# EAGLE design spi-devices (EAGLE 7.6.0)
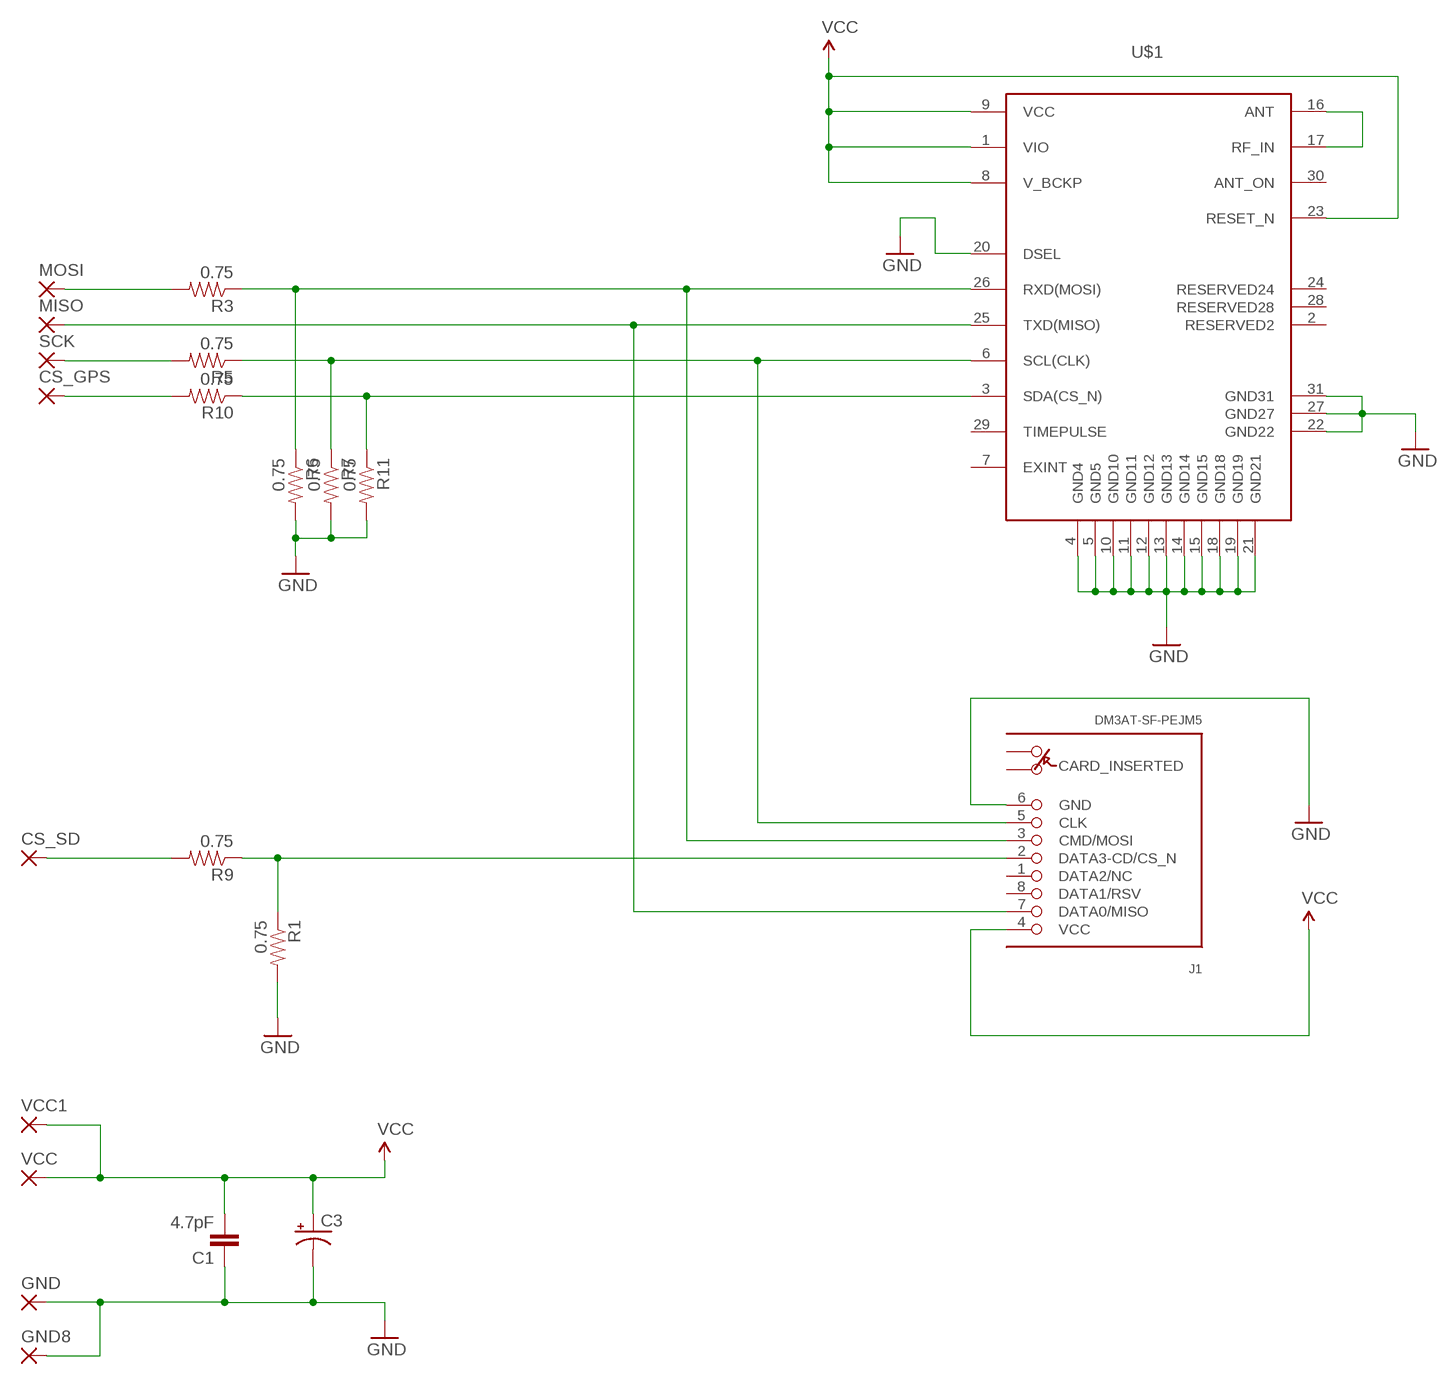
[diagram p0: schematic, sheet 1]

## Parts
C1  4.7pF  C-EUC0603  [C0603]
C3  CAP_POL3528  [EIA3528]
CS_GPS  2,54/0,9  [2,54/0,9]
CS_SD  2,54/0,9  [2,54/0,9]
GND  2,54/0,9  [2,54/0,9]
GND8  2,54/0,9  [2,54/0,9]
J1  DM3AT-SF-PEJM5  [DM3AT-SF-PEJM5]
MISO  2,54/0,9  [2,54/0,9]
MOSI  2,54/0,9  [2,54/0,9]
R1  0.75  0.75OHM-1/4W-1%(0805)  [0805]
R3  0.75  0.75OHM-1/4W-1%(0805)  [0805]
R5  0.75  0.75OHM-1/4W-1%(0805)  [0805]
R6  0.75  0.75OHM-1/4W-1%(0805)  [0805]
R7  0.75  0.75OHM-1/4W-1%(0805)  [0805]
R9  0.75  0.75OHM-1/4W-1%(0805)  [0805]
R10  0.75  0.75OHM-1/4W-1%(0805)  [0805]
R11  0.75  0.75OHM-1/4W-1%(0805)  [0805]
SCK  2,54/0,9  [2,54/0,9]
U$1  CAM-M8Q  [CAM-M8Q]
VCC  2,54/0,9  [2,54/0,9]
VCC1  2,54/0,9  [2,54/0,9]

## Nets
CS_GPS: CS_GPS.1(P) R10.2
CS_GPS_3.3: R10.1 R11.1 U$1.3(SDA(CS_N))
CS_SD: CS_SD.1(P) R9.2
CS_SD_3.3: J1.2(DATA3-CD/CS_N) R1.1 R9.1
GND: C1.1 C3.C(-) GND8.1(P) GND.1(P) J1.6(GND) R1.2 R6.2 R7.2 R11.2 U$1.4(GND4) U$1.5(GND5) U$1.10(GND10) U$1.11(GND11) U$1.12(GND12) U$1.13(GND13) U$1.14(GND14) U$1.15(GND15) U$1.18(GND18) U$1.19(GND19) U$1.20(DSEL) U$1.21(GND21) U$1.22(GND22) U$1.27(GND27) U$1.31(GND31)
MISO: J1.7(DATA0/MISO) MISO.1(P) U$1.25(TXD(MISO))
MOSI: MOSI.1(P) R3.2
MOSI3.3: J1.3(CMD/MOSI) R3.1 R6.1 U$1.26(RXD(MOSI))
RF: U$1.16(ANT) U$1.17(RF_IN)
SCK: R5.2 SCK.1(P)
SCK3.3: J1.5(CLK) R5.1 R7.1 U$1.6(SCL(CLK))
VCC: C1.2 C3.A(+) J1.4(VCC) U$1.1(VIO) U$1.8(V_BCKP) U$1.9(VCC) U$1.23(RESET_N) VCC1.1(P) VCC.1(P)
Unconnected: J1.1(DATA2/NC) J1.8(DATA1/RSV) J1.A J1.B U$1.2(RESERVED2) U$1.7(EXINT) U$1.24(RESERVED24) U$1.28(RESERVED28) U$1.29(TIMEPULSE) U$1.30(ANT_ON)

## Library data of the parts
C1 = rcl:C-EU: CAPACITOR, European symbol
C3 = SparkFun-Capacitors:CAP_POL: Capacitor Polarized These are standard SMD and PTH capacitors. Normally 10uF, 47uF, and 100uF in electrolytic and tantalum varieties. Always verify the external diameter of the through hole cap, it varies with capacity, voltage, and manufacturer. The EIA devices should be standard.
CS_GPS CS_SD GND GND8 MISO MOSI SCK VCC VCC1 = wirepad:2,54/0,9: THROUGH-HOLE PAD
J1 = connector:DM3AT-SF-PEJM5: CONN MICRO SD R/A PUSH-PUSH SMD; DIGIKEY: HR1964CT-ND
R1 R3 R5-R7 R9-R11 = SparkFun-Resistors:0.75OHM-1/4W-1%(0805): RES-08474; PROD_ID: RES-08474
U$1 = elements:CAM-M8Q: CAM‑M8 The CAM‑M8 modules are standalone GNSS antenna modules featuring the high performance u-blox M8 concurrent GNSS engine with reception of GPS, GLONASS, BeiDou and QZSS signals. Available in an industry standard form factor in leadless chip carrier (LCC) packages, it is easy to integrate and combines exceptional positioning performance with highly flexible power, design, and connectivity options. SMT pads allow fully automated assembly with standard pick & place and reflow-soldering equipment for cost-efficient, high-volume production enabling short time-to-market. datasheet: https://www.u-blox.com/sites/default/files/CAM-M8Q_DataSheet_%28UBX-13004081%29.pdf hw guide: https://www.u-blox.com/sites/default/files/CAM-M8_HardwareIntegrationManual_%28UBX-14000014%29.pdf

## Board
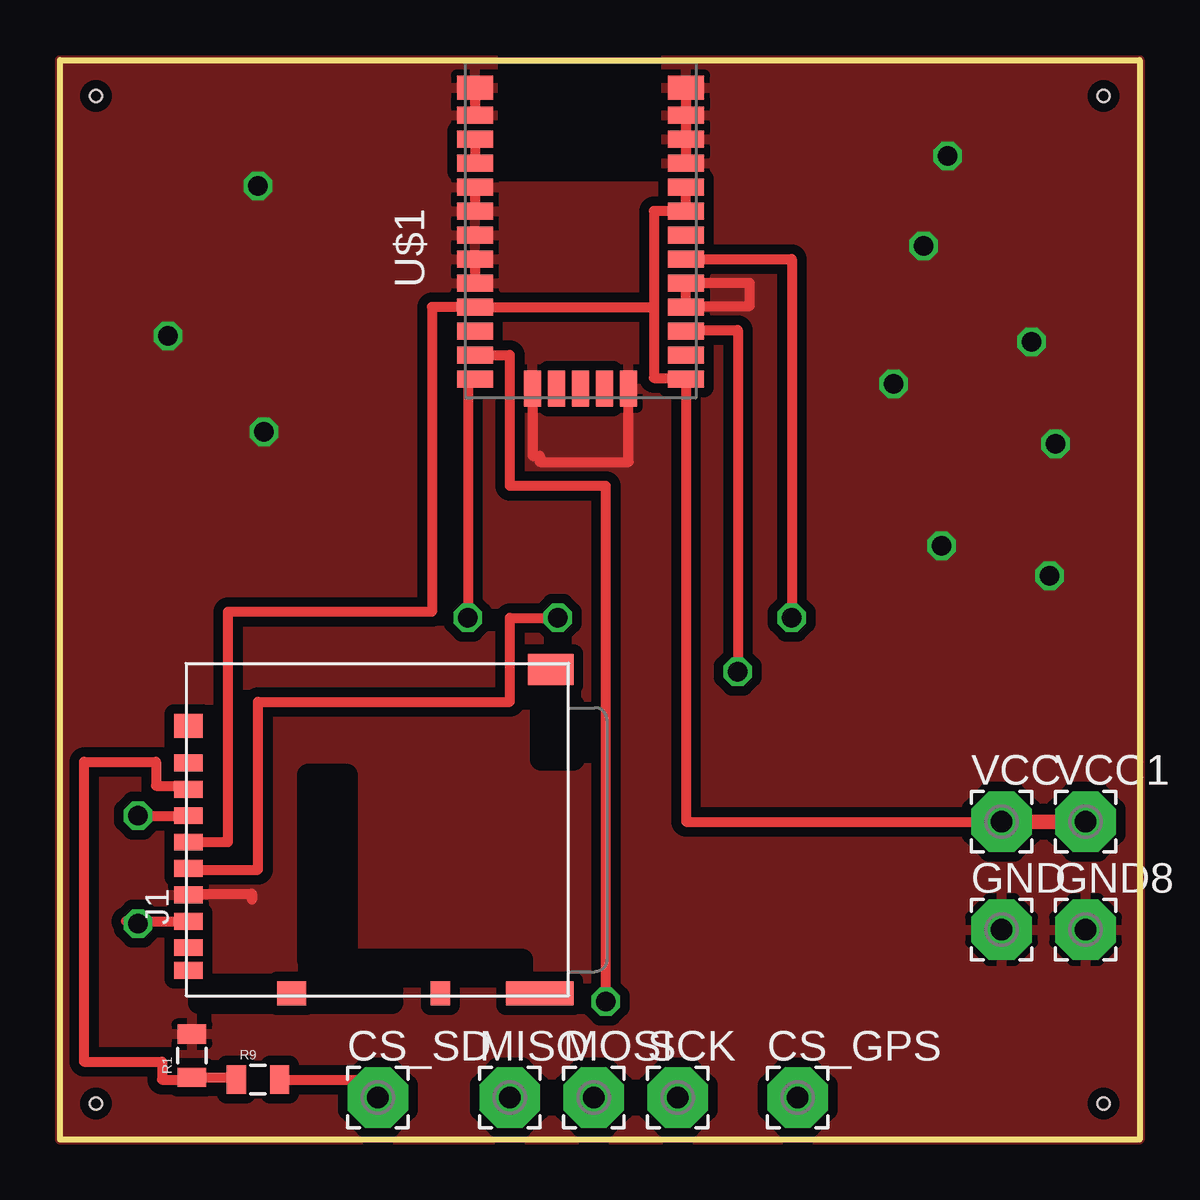
[diagram p1: board, top side]
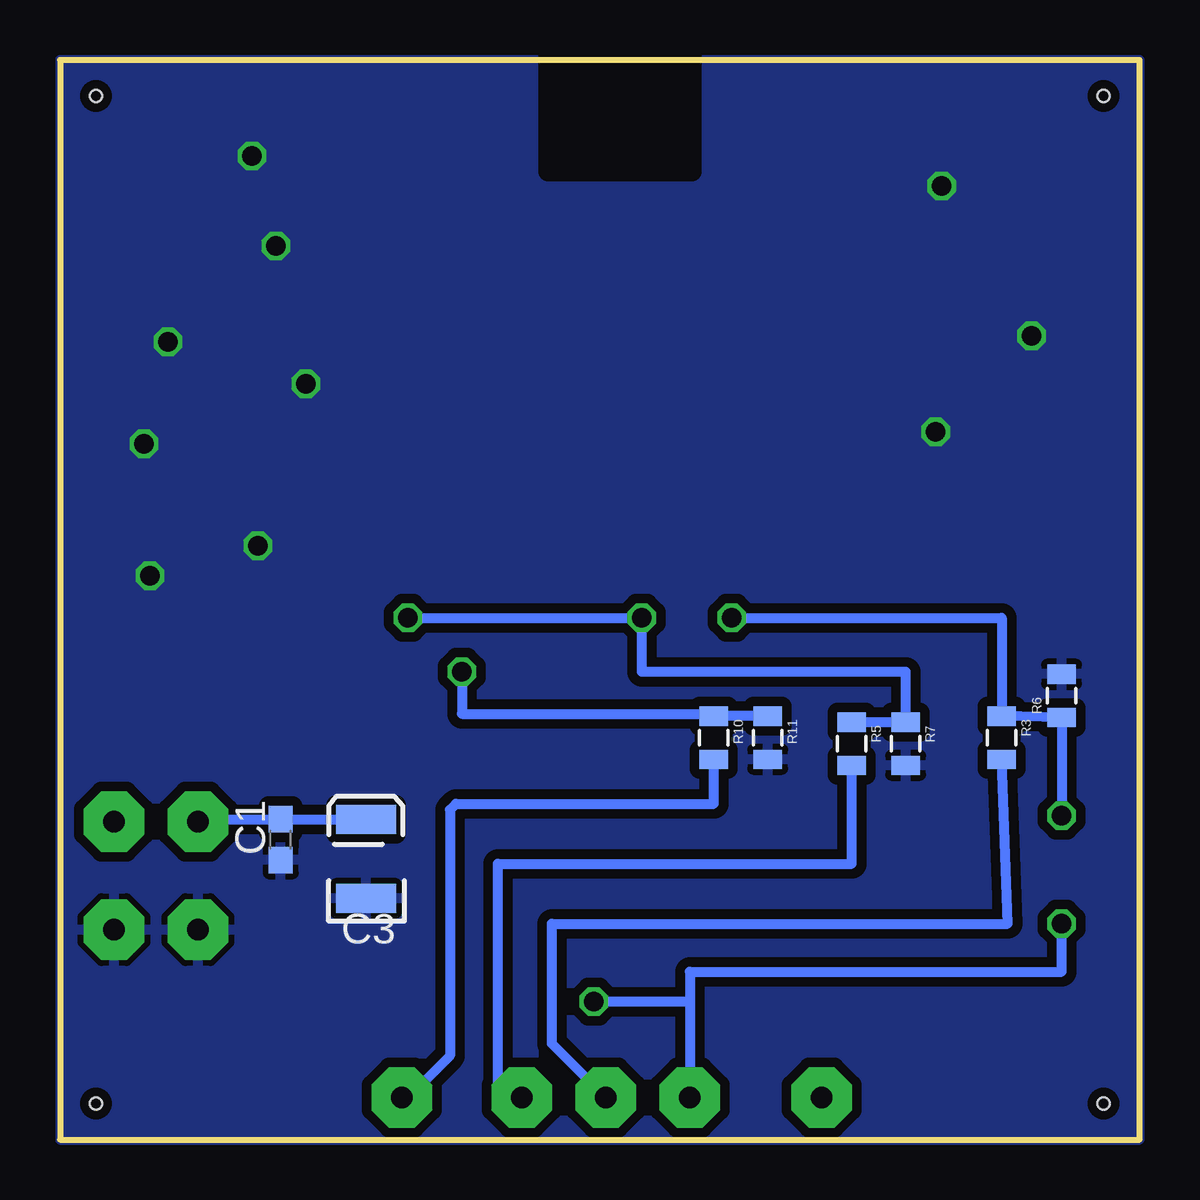
[diagram p2: board, bottom side, seen from below]

Size 45 x 45 mm. Coordinates in mm from the lower left corner, seen from the top.
Outline: 0,0 0,45 45,45 45,0 0,0
Copper layers (1*16): Top 0.035mm / dielectric 1mm / Bottom 0.035mm
Design rules "default *": minimum track width 10mil, minimum drill 1mm, track to track 8mil, track to pad 8mil, pad to pad 8mil, via to via 8mil, smd to smd 8mil, copper to edge 0mil, drill to drill 8mil, minimum pad ring 10mil, minimum via ring 8mil, stop-mask expansion 4mil, vias tented up to drill 0mil, thermal gap 10mil
Holes 0.5 mm at 1.5,1.5 43.5,1.5 43.5,43.5 1.5,43.5
tRestrict: area 18.6,40.4 to 24.6,45
bRestrict: area 18.6,40.4 to 24.6,45

### Footprints (pad centres in the part's own frame; a part is rotated, then mirrored left to right if it is on the bottom)
C0603 = smd 1.1 x 1: 1 -0.85,0; 2 0.85,0
EIA3528 = smd 1.2 x 2.5: A 1.65,0; C -1.65,0
2,54/0,9 = drill 0.914 pad 2.54 octagon: 1 0,0
DM3AT-SF-PEJM5 = smd 0.7 x 1.2: 1 3.2,-0.1; 2 2.1,-0.1; 3 1,-0.1; 4 -0.1,-0.1; 5 -1.2,-0.1; 6 -2.3,-0.1; 7 -3.4,-0.1; 8 -4.5,-0.1; B -5.45,-0.1 | smd 1 x 0.8: A -6.4,-10.6 | smd 1 x 1.2: MOUNT0 4.75,-0.1; MOUNT1 -6.4,-4.4 | smd 1 x 2.8: MOUNT2 -6.4,-14.75 | smd 1.3 x 1.9: MOUNT3 7.1,-15.2
0805 = smd 0.8 x 1.2: 1 -0.9,0; 2 0.9,0
CAM-M8Q = smd 0.7 x 1.5: 1 -6.2,-4.4; 2 -5.2,-4.4; 3 -4.2,-4.4; 4 -3.2,-4.4; 5 -2.2,-4.4; 6 -1.2,-4.4; 7 -0.2,-4.4; 8 0.8,-4.4; 9 1.8,-4.4; 10 2.8,-4.4; 11 3.8,-4.4; 12 4.8,-4.4; 15 4.8,4.4; 16 3.8,4.4; 17 2.8,4.4; 18 1.8,4.4; 19 0.8,4.4; 20 -0.2,4.4; 21 -1.2,4.4; 22 -2.2,4.4; 23 -3.2,4.4; 24 -4.2,4.4; 25 -5.2,4.4; 26 -6.2,4.4 | smd 1 x 1.5: 13 5.95,-4.4; 14 5.95,4.4 | smd 1.5 x 0.7: 27 -6.6,2; 28 -6.6,1; 29 -6.6,0; 30 -6.6,-1; 31 -6.6,-2

### Placement (x,y rotation side)
C1  35.8,12.5 90 bottom
C3  32.25,11.7 90 bottom
CS_GPS  30.75,1.75 0 top
CS_SD  13.25,1.75 0 top
GND  39.25,8.75 0 top
GND8  42.75,8.75 0 top
J1  5.25,12.5 90 top
MISO  18.75,1.75 0 top
MOSI  22.25,1.75 0 top
R1  5.5,3.5 90 top
R3  5.75,16.75 270 bottom
R5  12,16.5 270 bottom
R6  3.25,18.5 90 bottom
R7  9.75,16.5 270 bottom
R9  8.25,2.5 0 top
R10  17.75,16.75 270 bottom
R11  15.5,16.75 270 bottom
SCK  25.75,1.75 0 top
U$1  21.7,37.9 90 top
VCC  39.25,13.25 0 top
VCC1  42.75,13.25 0 top

### Tracks (layer width: path | path; a pad name or v marks a point on that pad's centre or on a via)
CS_GPS
  Bottom 0.406: R10.2 17.75,14 28.5,14 28.75,13.75 28.75,3.5 30.5,1.75 CS_GPS.1
CS_GPS_3.3  (via drill 0.8)
  Top 0.406: U$1.3 26.1,33.75 28.25,33.75 v28.25,19.5
  Bottom 0.406: R11.1 R10.1 17.75,17.75 28.25,17.75 v28.25,19.5
CS_SD
  Top 0.406: R9.2 13.25,2.5 CS_SD.1
CS_SD_3.3
  Top 0.406: J1.2 5.35,14.75 4,14.75 4,15.75 1,15.75 1,3.25 4.25,3.25 4.25,2.5 5.5,2.5 R1.1 7.35,2.6 R9.1
GND  (via drill 0.8)
  Top 0.406: U$1.14 U$1.15 | U$1.18 U$1.19 | U$1.21 U$1.22 | U$1.13 U$1.12 U$1.11 U$1.10 | U$1.4 U$1.5 | 26,34.75 28.75,34.75 28.75,35.7 U$1.5 | J1.6 5.35,10.25 8,10.25 8,10 | 26.1,35.75 U$1.5 | U$1.27 19.7,28.5 20,28.5 20,28.25 23.7,28.25 U$1.31
  other vias: 8.25,39.75 4.5,33.5 8.5,29.5 37,41 34.75,31.5 40.5,33.25 41.5,29 36.75,24.75 41.25,23.5 36,37.25
  pour Bottom (isolate 0.406): 0,45 45,45 45,0 0,0
  pour Top (isolate 0.406): 0,0 0,45 45,45 45,0
MISO  (via drill 0.8)
  Top 0.406: v3.25,9 2.75,9.1 J1.7 | U$1.25 18.75,32.7 18.75,27.25 22.75,27.25 v22.75,5.75
  Bottom 0.406: v3.25,9 3.25,7 18.75,7 18.75,5.75 | 18.75,5.75 v22.75,5.75 | 18.75,5.75 MISO.1
MOSI
  Bottom 0.406: R3.2 5.5,9 24.5,9 24.5,4 MOSI.1
MOSI3.3  (via drill 0.8)
  Top 0.406: v3.25,13.5 J1.3 | 17.3,31.75 U$1.26 17,31.7 v17,21.75
  Bottom 0.406: v3.25,13.5 R6.1 R3.1 5.75,21.75 v17,21.75
RF
  Top 0.406: U$1.16 U$1.17
SCK
  Bottom 0.406: R5.2 12,11.5 26.75,11.5 26.75,1.75 SCK.1
SCK3.3  (via drill 0.8)
  Top 0.406: U$1.6 30.5,36.7 v30.5,21.75 | J1.5 5.35,11.25 8.25,11.25 8.25,18.25 18.75,18.25 18.75,21.75 v20.75,21.75
  Bottom 0.406: R5.1 R7.1 9.75,19.5 20.75,19.5 v20.75,21.75 v30.5,21.75
VCC
  Top 0.406: U$1.9 U$1.8 24.75,38.7 24.75,34.7 | 24.75,34.7 24.75,31.75 26.05,31.75 | J1.4 7,12.4 7,22 15.5,22 15.5,34.7 U$1.23 24.75,34.7 | VCC1.1 42.1,13.25 | U$1.1 26.1,13.25 VCC.1
  Top 0.61: VCC1.1 VCC.1 | 26.05,31.75 U$1.1
  Bottom 0.406: VCC.1 39.15,13.35 C1.2 C3.A